# Altium schematic sheet USB_PD_Controller.SchDoc
size A3; SheetNumber: 2; SheetTotal: 8
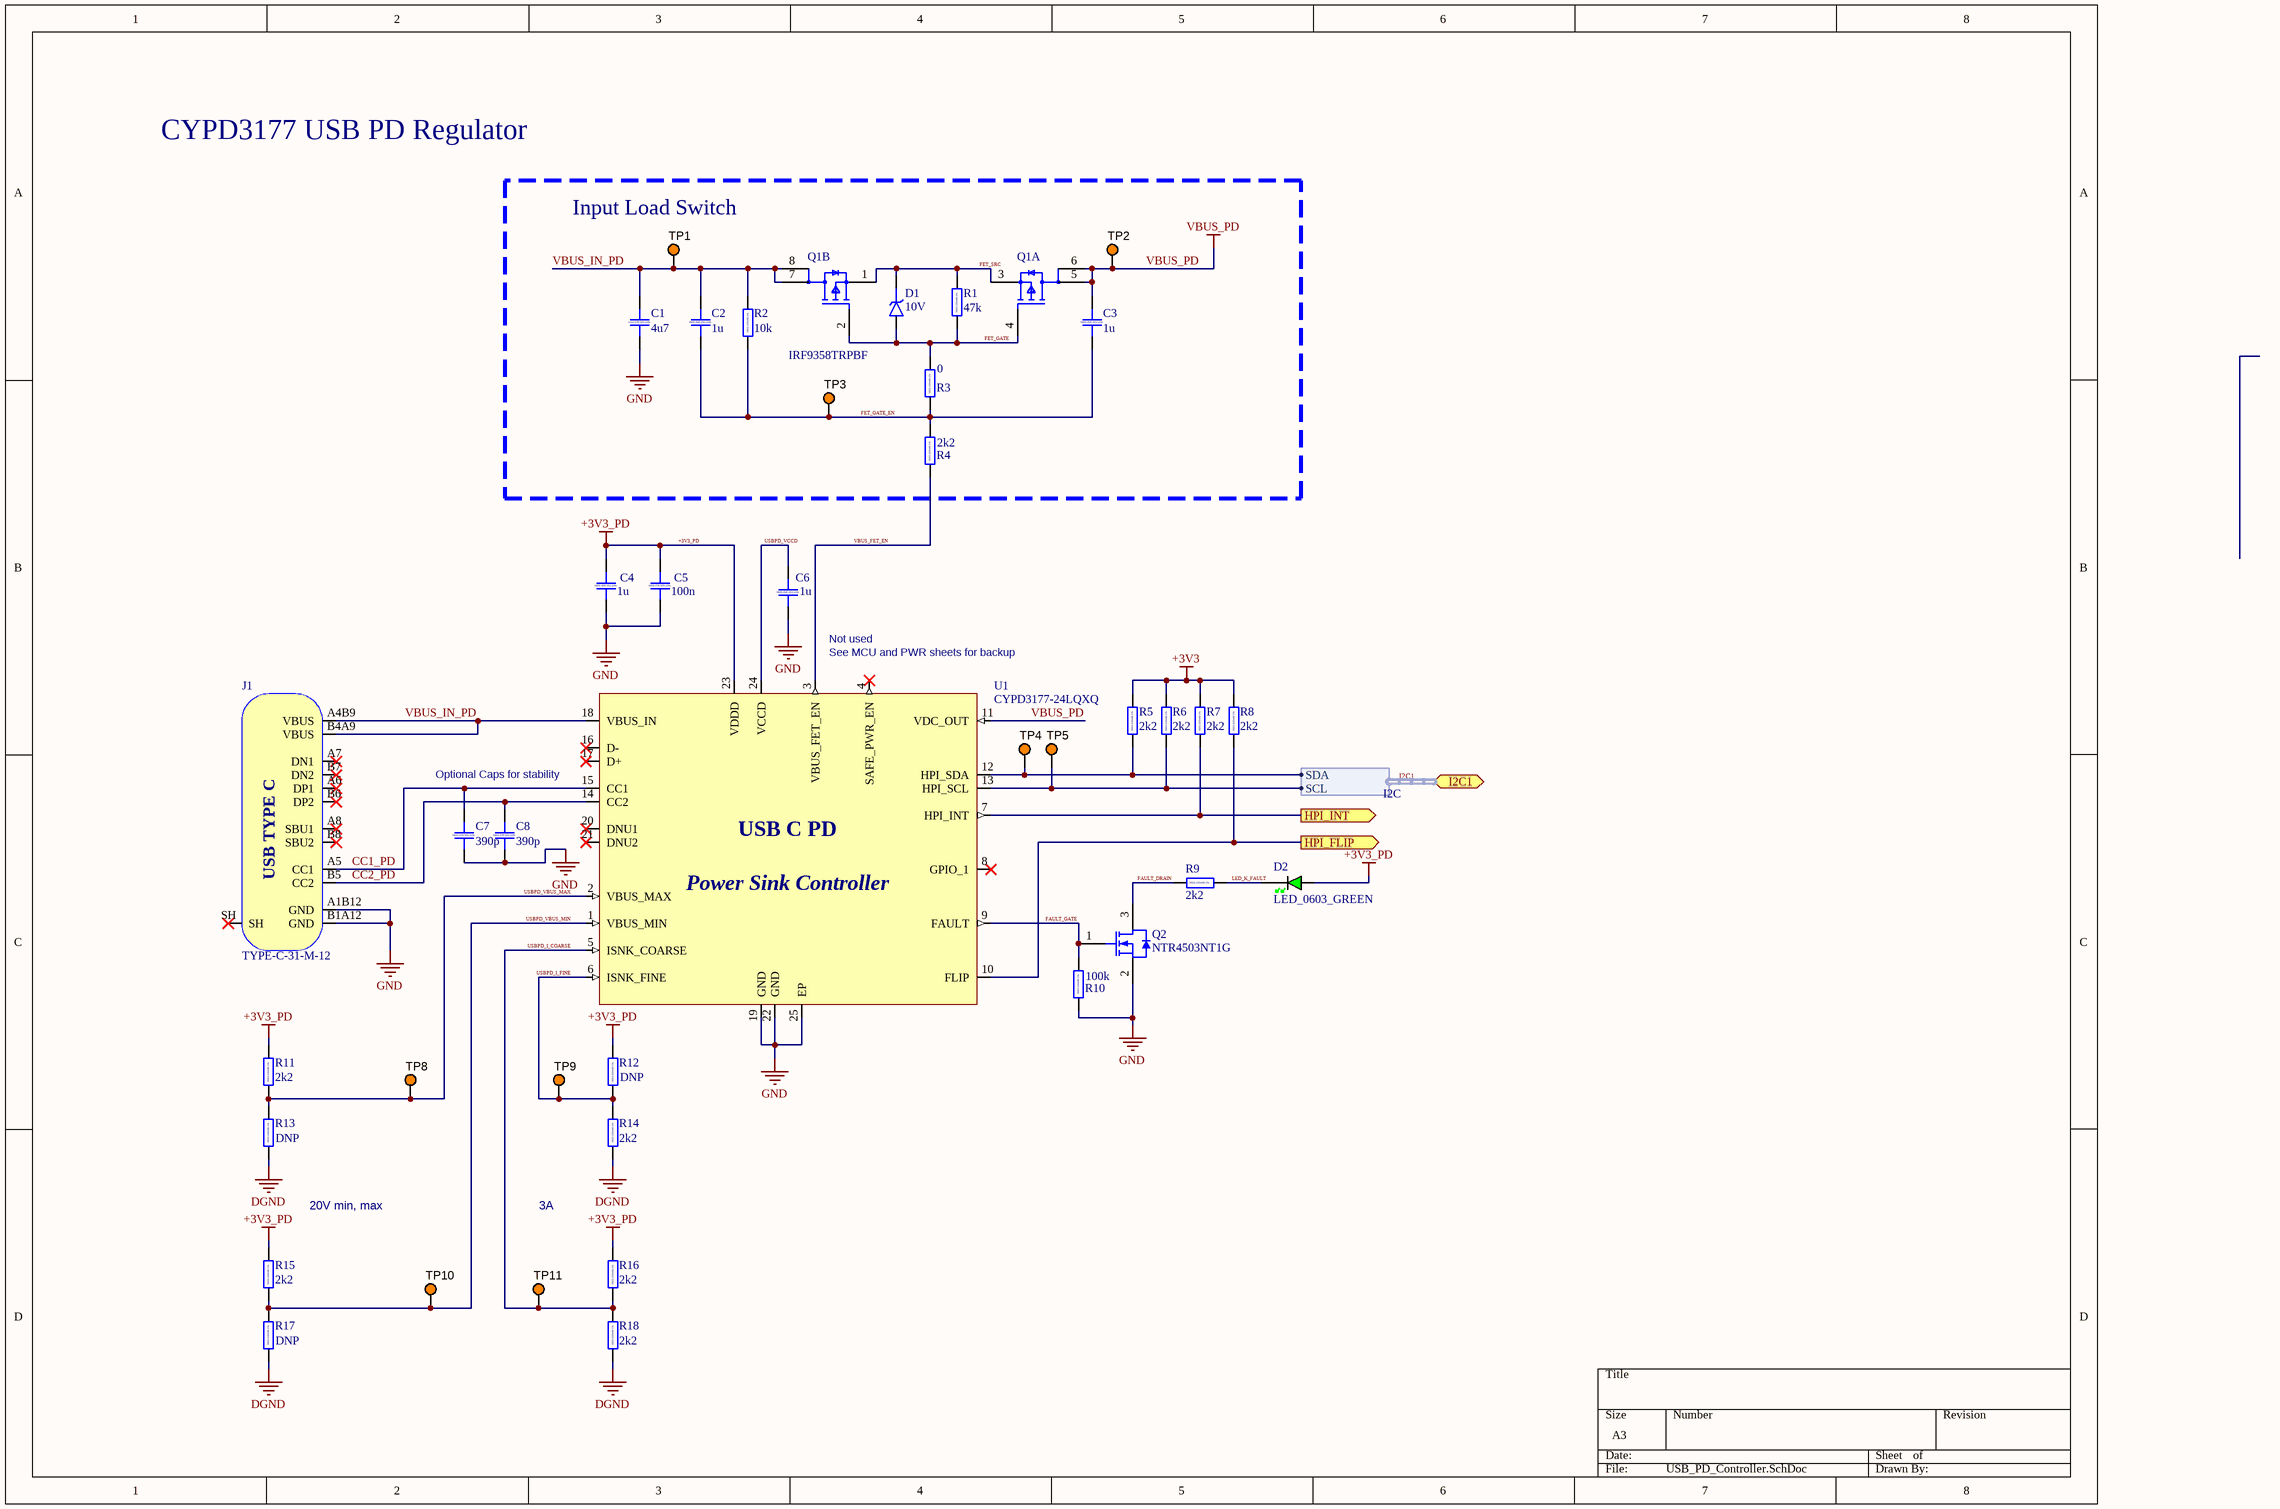
[diagram p0: USB_PD_Controller.SchDoc]

## Parts
C1  4u7  [CAP_1210]
C2  1u  [CAP_0805]
C3  1u  [CAP_0805]
C4  1u  [CAP_0805]
C5  100n  [CAP_0603]
C6  1u  [CAP_0805]
C7  390p  [CAP_0603]
C8  390p  [CAP_0603]
D1  10V  [SOD-323]
D2  LED_0603_GREEN  [LED_0603_GREEN]
J1  TYPE-C-31-M-12  [TYPE-C-31-M-12]
Q1  IRF9358TRPBF  [FP-PG-DSO-8-IPC_A]  (value not drawn)  (parts A,B of 2)
Q2  NTR4503NT1G  [ONSC-SOT-23-3-318-08_V]
R1  47k  [RES_0603]
R2  10k  [RES_0603]
R3  0  [RES_0603]
R4  2k2  [RES_0603]
R5  2k2  [RES_0603]
R6  2k2  [RES_0603]
R7  2k2  [RES_0603]
R8  2k2  [RES_0603]
R9  2k2  [RES_0603]
R10  100k  [RES_0603]
R11  2k2  [RES_0603]
R12  DNP  [RES_0603]  (no BOM)
R13  DNP  [RES_0603]  (no BOM)
R14  2k2  [RES_0603]
R15  2k2  [RES_0603]
R16  2k2  [RES_0603]
R17  DNP  [RES_0603]  (no BOM)
R18  2k2  [RES_0603]
TP1  5003  [KSTN-5003]  (value not drawn)
TP2  5003  [KSTN-5003]  (value not drawn)
TP3  5003  [KSTN-5003]  (value not drawn)
TP4  5003  [KSTN-5003]  (value not drawn)
TP5  5003  [KSTN-5003]  (value not drawn)
TP8  5003  [KSTN-5003]  (value not drawn)
TP9  5003  [KSTN-5003]  (value not drawn)
TP10  5003  [KSTN-5003]  (value not drawn)
TP11  5003  [KSTN-5003]  (value not drawn)
U1  CYPD3177-24LQXQ  [QFN-24-0MM5]

## Blocks framed on the sheet
Input Load Switch: C1-C3 D1 Q1 R1-R4 TP1-TP3

## Ports
HPI_FLIP (out), HPI_INT (out), I2C1 (bidir, harness I2C)

## Harnesses
I2C: SCL, SDA

## Nets
+3V3: R5.2 R6.2 R7.2 R8.2
+3V3_PD: C4.2 C5.1 D2.A R11.2 R12.2 R15.2 R16.2 U1.23(VDDD)
DGND: R13.1 R14.1 R17.1 R18.1
GND: C1.1 C4.1 C5.2 C6.1 C7.2 C8.2 J1.A1B12(GND) J1.B1A12(GND) Q2.2(S) R10.1 U1.19(GND) U1.22(GND) U1.25(EP)
VBUS_PD: C3.2 Q1.5(D1) Q1.6(D1) TP2.1 U1.11(VDC_OUT)
CC1_PD: C7.1 J1.A5(CC1) U1.15(CC1)
CC2_PD: C8.1 J1.B5(CC2) U1.14(CC2)
FAULT_DRAIN: Q2.3(D) R9.1
FAULT_GATE: Q2.1(G) R10.2 U1.9(FAULT)
FET_GATE: D1.A Q1.2(G2) Q1.4(G1) R1.1 R3.2
FET_GATE_EN: C2.1 C3.1 R2.1 R3.1 R4.2 TP3.1
FET_SRC: D1.K Q1.1(S2) Q1.3(S1) R1.2
HPI_FLIP: R8.1 U1.10(FLIP) ; port HPI_FLIP
HPI_INT: R7.1 U1.7(HPI_INT) ; port HPI_INT
I2C1.SCL: R6.1 TP5.1 U1.13(HPI_SCL) ; port I2C1.SCL
I2C1.SDA: R5.1 TP4.1 U1.12(HPI_SDA) ; port I2C1.SDA
USBPD_I_COARSE: R16.1 R18.2 TP11.1 U1.5(ISNK_COARSE)
USBPD_I_FINE: R12.1 R14.2 TP9.1 U1.6(ISNK_FINE)
USBPD_VBUS_MAX: R11.1 R13.2 TP8.1 U1.2(VBUS_MAX)
USBPD_VBUS_MIN: R15.1 R17.2 TP10.1 U1.1(VBUS_MIN)
USBPD_VCCD: C6.2 U1.24(VCCD)
VBUS_FET_EN: R4.1 U1.3(VBUS_FET_EN)
VBUS_IN_PD: C1.2 C2.2 J1.A4B9(VBUS) J1.B4A9(VBUS) Q1.7(D2) Q1.8(D2) R2.2 TP1.1 U1.18(VBUS_IN)
NetD2_K: D2.K R9.2

Not connected (* = marked no-connect by the designer): J1 A6(DP1)* A7(DN1)* A8(SBU1)* B6(DP2)* B7(DN2)* B8(SBU2)* SH*; U1 4(SAFE_PWR_EN)* 8(GPIO_1)* 16(D-)* 17(D+)* 20(DNU1)* 21(DNU2)*

## Buses and harness runs
harness I2C1 = port I2C1

## Notes on the sheet
- CYPD3177 USB PD Regulator
- Not used
- (near U1) See MCU and PWR sheets for backup
- Optional Caps for stability
- 20V min, max
- 3A
- Labels drawn without touching a wire or pin: LED_K_FAULT
- (in symbol CMP-001-00113-3) 0603 X7R 50V 10%
- (in symbol CMP-001-38826-1) 0805 X5R 25V 10%
- (in symbol CMP-001-38827-2) 1210 X7R 50V 10%
- (in symbol CMP-002-00119-1) USB TYPE C
- (in symbol CMP-009-00179-5) 0603 100mW 1%
- (in symbol CMP-024-000234-1) USB C PD; Power Sink Controller

## Library data of the parts
C1 = CMP-001-38827-2: Capacitor SMD 1210; Value: 4u7; Design Item ID: CAP_1210; Manufacturer: *; Source: Schematic-Lib-PhilsLab.SchLib; Manufacturer Part Number: *; Distributor Link: *; Rating: *; Dielectric: *; LCSC: *
C2-C4 C6 = CMP-001-38826-1: Capacitor SMD 0805; Manufacturer Part Number: *; Rating: *; Dielectric: *; Design Item ID: CAP_0805; Manufacturer: *; Value: 1u; Distributor Link: *; LCSC: *; Source: Schematic-Lib-PhilsLab.SchLib
C5 C7 C8 = CMP-001-00113-3: Capacitor SMD 0603; LCSC: *; Rating: *; Dielectric: *; Design Item ID: CAP_0603; Distributor Link: *; Manufacturer: *; Source: Schematic-Lib-PhilsLab.SchLib; Manufacturer Part Number: *
  C5: Value: 100n
  C7 C8: Value: 390p
D1 = CMP-004-00053-1: Diode Zener SMD SOD-323; Source: Schematic-Lib-PhilsLab.SchLib; Design Item ID: D_ZENER_SOD_323
D2 = CMP-004-00051-1: LED 0603 GREEN SMD; Source: Schematic-Lib-PhilsLab.SchLib; Design Item ID: LED_0603_GREEN
J1 = CMP-002-00119-1: USB Type C Connector Horizontal SMT; Manufacturer: Koren Hroparts; Source: Schematic-Lib-PhilsLab.SchLib; Manufacturer Part Number: TYPE-C-31-M-12; Design Item ID: TYPE-C-31-M-12
Q1 = CMP-32901-000912-1: MOSFET 2P-CH 30V 9.2A 8SOIC; Max Dual Supply Voltage: -30V; Max Power Dissipation: 2W; Rds On Max: 16.3mR; Threshold Voltage: -1.8V; Input Capacitance: 1.74nF; Packaging: Cut Tape; Min Operating Temperature: -55°C; Series: HEXFET®; Mount: Surface Mount; Max Operating Temperature: 150°C; Lead Free: Lead Free; Halogen Free: Halogen Free; Continuous Drain Current (ID): 9.2A; Drain to Source Voltage (Vdss): -30V; Case/Package: SO; Number of Pins: 8; RoHS Compliant: Yes
Q2 = CMP-1058-00742-1: Power MOSFET, 30 V, 2.5 A, Single N-Channel, 3-Pin SOT-23, Pb-Free, Tape and Reel; Manufacturer: On Semiconductor; Qrr Typ (nC): 4; ID Max (A): 2.5; VGS(th) Max (V): 3; VGS Max (V): 20; Channel Polarity: N Channel; V(BR)DSS Min (V): 30; ComponentLink3URL: http://www.onsemi.cn/pub_link/Collateral/318-08.PDF; PackageReference: SOT-23-3-318-08; ComponentLink2URL: http://www.onsemi.cn/pub_link/Collateral/NTR4503N-D.PDF; ComponentLink2Description: Datasheet; ComponentLink1Description: Manufacturer URL; Configuration: Single; ComponentLink1URL: http://www.onsemi.com/; PackageVersion: Rev. AP, 11/2009; Package Type: SOT-23-3; DatasheetVersion: Rev. 6; ComponentLink3Description: Package Specification; PartNumber: NTR4503NT1G; Packing: Tape and Reel; RoHS: Pb-Free; Mounting Technology: Surface Mount; PackageDescription: 3-Pin Small Outline Transistor, Body 2.92 x 1.3 mm, Pitch 0.95 mm
R1-R18 = CMP-009-00179-5: Resistor 0603 100mW 1%; LCSC: *; Distributor Link: *; Manufacturer Part Number: *; Design Item ID: RES_0603; Manufacturer: *; Source: Schematic-Lib-PhilsLab.SchLib
  R1: Value: 47k
  R2: Value: 10k
  R3: Value: 0
  R4-R9 R11 R14-R16 R18: Value: 2k2
  R10: Value: 100k
TP1-TP5 TP8-TP11 = CMP-002-00037-2: Test Point, Orange, Height 4.6 mm, Tail Length 3 mm, 1-Pin THD, RoHS; Manufacturer: Keystone; Colour: Orange; Packaging: Bulk; Package Description: 1-Pin Through Hole Device, Dia 2.54 mm; Pins: 1; Package Reference: 5003; Datasheet Version: Jun-15; Case/Package: 5003; Mounting Technology: TH; Connector Type: TestPoint; Diameter: 2.54mm; Contact Material: Bronze; Datasheet URL: http://keyelco.com/userAssets/file/M65p56.pdf; Manufacturer URL: http://www.keyelco.com/; Package Quantity: 10; Contact Plating: Tin; RoHS Compliant: True
U1 = CMP-024-000234-1: USB Type-C Port Controller for Power Sinks; Manufacturer: Cypress Semicon; Distributor Link: https://www.lcsc.com/product-detail/USB-ICs_Cypress-Semicon-CYPD3177-24LQXQ_C2959321.html; Design Item ID: CYPD3177-24LQXQ; Source: Schematic-Lib-PhilsLab.SchLib; Manufacturer Part Number: CYPD3177-24LQXQ